# Altium schematic sheet SiLabsProg2_V14C.SchDoc
size A2; PageSetup: Record=PageOptions|CenterHorizontal=True|CenterVertical=True|PrintScale=0.97|XCorrection=1.00|YCorrection=1.00|PrintKind=2|BorderSize=5000000|LeftOffset=0|BottomOffset=0|Orientation=2|PaperLength=1000|PaperWidth=1000|Scale=100|PaperSource=7|PrintQuality=-4|MediaType=1|DitherType=10|PaperKind=A4|PrintScaleMode=1
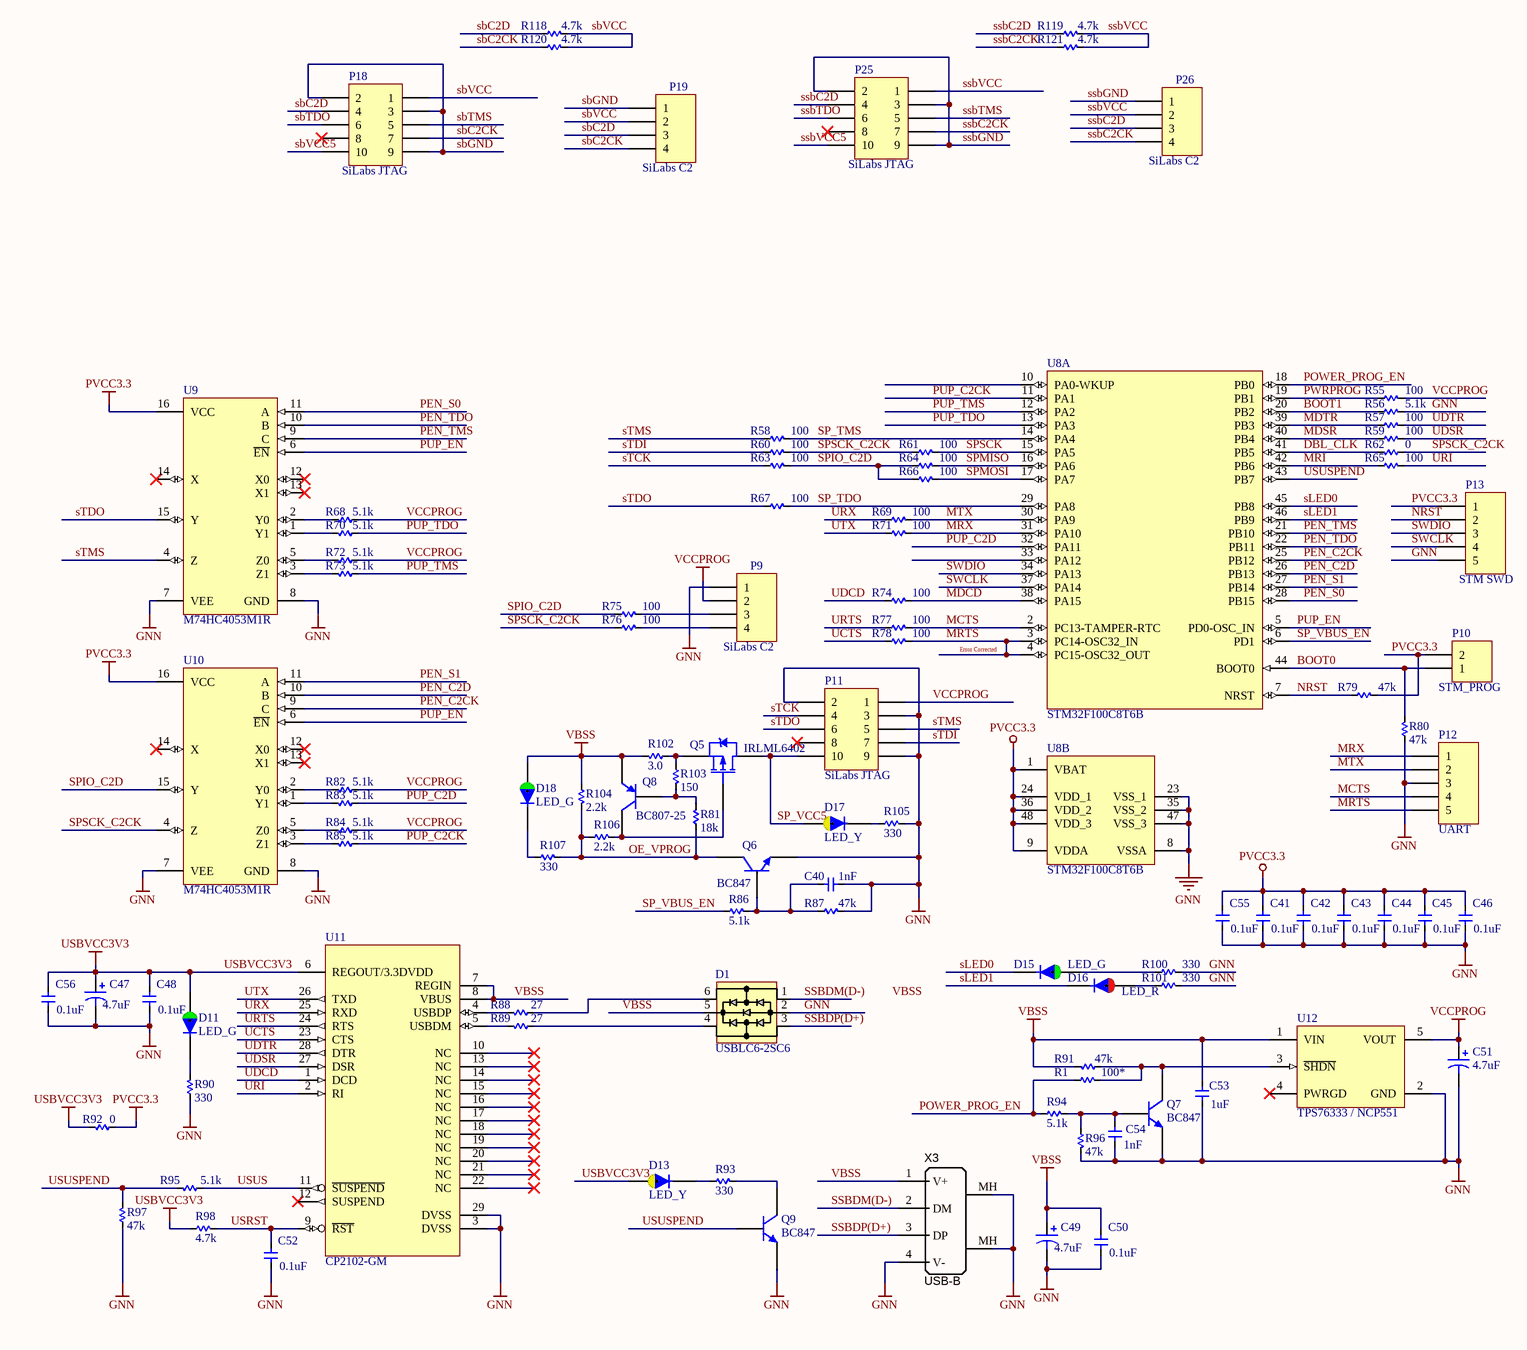
[diagram p0: SiLabsProg2_V14C.SchDoc]

## Parts
C40  1nF  [R1608_CAP]
C41  0.1uF  [R1005_CAP]
C42  0.1uF  [R1005_CAP]
C43  0.1uF  [R1005_CAP]
C44  0.1uF  [R1005_CAP]
C45  0.1uF  [R1005_CAP]
C46  0.1uF  [R1005_CAP]
C47  4.7uF  [CAPC3225L]
C48  0.1uF  [R1005_CAP]
C49  4.7uF  [CAPC3225L]
C50  0.1uF  [R1005_CAP]
C51  4.7uF  [CAPC3225L]
C52  0.1uF  [R1005_CAP]
C53  1uF  [R1608_CAP]
C54  1nF  [R1608_CAP]
C55  0.1uF  [R1005_CAP]
C56  0.1uF  [R1005_CAP]
D1  USBLC6-2SC6  [SOT23-6]
D11  LED_G  [LED3G]
D13  LED_Y  [LED3Y]
D15  LED_G  [LED3G]
D16  LED_R  [LED3R]
D17  LED_Y  [LED3Y]
D18  LED_G  [LED3G]
P9  SiLabs C2  [HDR1X4]
P10  STM_PROG  [HDR1X2]
P11  SiLabs JTAG  [HDR2X5]
P12  UART  [HDR1X5]
P13  STM SWD  [HDR1X5]
P18  SiLabs JTAG  [HDR2X5]
P19  SiLabs C2  [HDR1X4]
P25  SiLabs JTAG  [HDR2X5]
P26  SiLabs C2  [HDR1X4]
Q5  IRLML6402  [SOT23-1]
Q6  BC847  [SOT23-1]
Q7  BC847  [SOT23-1]
Q8  BC807-25  [SOT23-1]
Q9  BC847  [SOT23-1]
R1  100*  [R1608_RES]
R55  100  [R1608_RES]
R56  5.1k  [R1608_RES]
R57  100  [R1608_RES]
R58  100  [R1608_RES]
R59  100  [R1608_RES]
R60  100  [R1608_RES]
R61  100  [R1608_RES]
R62  0  [R1608_RES]
R63  100  [R1608_RES]
R64  100  [R1608_RES]
R65  100  [R1608_RES]
R66  100  [R1608_RES]
R67  100  [R1608_RES]
R68  5.1k  [R1608_RES]
R69  100  [R1608_RES]
R70  5.1k  [R1608_RES]
R71  100  [R1608_RES]
R72  5.1k  [R1608_RES]
R73  5.1k  [R1608_RES]
R74  100  [R1608_RES]
R75  100  [R1608_RES]
R76  100  [R1608_RES]
R77  100  [R1608_RES]
R78  100  [R1608_RES]
R79  47k  [R1608_RES]
R80  47k  [R1608_RES]
R81  18k  [R1608_RES]
R82  5.1k  [R1608_RES]
R83  5.1k  [R1608_RES]
R84  5.1k  [R1608_RES]
R85  5.1k  [R1608_RES]
R86  5.1k  [R1608_RES]
R87  47k  [R1608_RES]
R88  27  [R1608_RES]
R89  27  [R1608_RES]
R90  330  [R1608_RES]
R91  47k  [R1608_RES]
R92  0  [R1608_RES]
R93  330  [R1608_RES]
R94  5.1k  [R1608_RES]
R95  5.1k  [R1608_RES]
R96  47k  [R1608_RES]
R97  47k  [R1608_RES]
R98  4.7k  [R1608_RES]
R100  330  [R1608_RES]
R101  330  [R1608_RES]
R102  3.0  [R1608_RES]
R103  150  [R1608_RES]
R104  2.2k  [R1608_RES]
R105  330  [R1608_RES]
R106  2.2k  [R1608_RES]
R107  330  [R1608_RES]
R118  value 4.7k  [R1608_RES]  (hidden comment: R)
R119  value 4.7k  [R1608_RES]  (hidden comment: R)
R120  value 4.7k  [R1608_RES]  (hidden comment: R)
R121  value 4.7k  [R1608_RES]  (hidden comment: R)
U8  STM32F100C8T6B  [LQFP48_N]  (parts A,B of 2)
U9  M74HC4053M1R  [SO16_N]
U10  M74HC4053M1R  [SO16_N]
U11  CP2102-GM  [QFN28]
U12  TPS76333 / NCP551  [SOT23-5D]
X3  USB-B  [USB_TypeB_Tyco]

## Nets
GNN: C40.1 C41.1 C42.1 C43.1 C44.1 C45.1 C46.1 C47.2 C48.1 C49.2 C50.1 C51.2 C52.1 C53.1 C54.1 C55.1 C56.1 D1.2(GND) P9.1 P11.2 P11.3 P11.9 P12.3 P13.5 Q6.2(E) Q7.2(E) Q9.2(E) R56.2 R80.1 R87.2 R90.1 R96.2 R97.1 R100.2 R101.2 R105.2 U8.8(VSSA) U8.23(VSS_1) U8.35(VSS_2) U8.47(VSS_3) U9.7(VEE) U9.8(GND) U10.7(VEE) U10.8(GND) U11.3(DVSS) U11.29(DVSS) U12.2(GND) X3.4(V-) X3.MH(Shell)
PVCC3.3: C41.2 C42.2 C43.2 C44.2 C45.2 C46.2 C55.2 P10.2 P13.1 R79.2 R92.1 U8.1(VBAT) U8.9(VDDA) U8.24(VDD_1) U8.36(VDD_2) U8.48(VDD_3) U9.16(VCC) U10.16(VCC)
USBVCC3V3: C47.1 C48.2 C56.2 D11.2(A) D13.2(A) R92.2 R98.1 U11.6(REGOUT/3.3DVDD)
VBSS: C49.1 C50.2 C53.2 D1.5(VP) D18.2(A) Q8.2(E) R91.2 R102.2 R104.1 U11.7(REGIN) U11.8(VBUS) U12.1(VIN) X3.1(V+)
VCCPROG: C51.1 P9.2 P11.1 R55.2 R68.1 R72.1 R82.1 R84.1 U12.5(VOUT)
BOOT0: P10.1 R80.2 U8.44(BOOT0)
BOOT1: R56.1 U8.20(PB2)
DBL_CLK: R62.2 U8.41(PB5)
MCTS: P12.4 R77.2 U8.2(PC13-TAMPER-RTC)
MDCD: R74.2 U8.38(PA15)
MDSR: R59.1 U8.40(PB4)
MDTR: R57.1 U8.39(PB3)
MRI: R65.1 U8.42(PB6)
MRTS: P12.5 R78.2 U8.3(PC14-OSC32_IN) U8.4(PC15-OSC32_OUT)
MRX: P12.1 R71.2 U8.31(PA10)
MTX: P12.2 R69.2 U8.30(PA9)
NRST: P13.2 R79.1 U8.7(NRST)
OE_VPROG: Q6.3(C) R81.1 R104.2 R106.1 R107.2
PEN_C2CK: U8.25(PB12) U10.9(C)
PEN_C2D: U8.26(PB13) U10.10(B)
PEN_S0: U8.28(PB15) U9.11(A)
PEN_S1: U8.27(PB14) U10.11(A)
PEN_TDO: U8.22(PB11) U9.10(B)
PEN_TMS: U8.21(PB10) U9.9(C)
POWER_PROG_EN: R1.1 R94.1 U8.18(PB0)
PUP_C2CK: R85.1 U8.11(PA1)
PUP_C2D: R83.1 U8.32(PA11)
PUP_EN: U8.5(PD0-OSC_IN) U9.6(~{EN}) U10.6(~{EN})
PUP_TDO: R70.1 U8.13(PA3)
PUP_TMS: R73.1 U8.12(PA2)
PWRPROG: R55.1 U8.19(PB1)
sbC2CK: P18.7 P19.4 R120.1
sbC2D: P18.4 P19.3 R118.1
sbGND: P18.2 P18.3 P18.9 P19.1
sbTDO: P18.6
sbTMS: P18.5
sbVCC: P18.1 P19.2 R118.2 R120.2
sbVCC5: P18.10
sLED0: D15.1(K) U8.45(PB8)
sLED1: D16.1(K) U8.46(PB9)
SP_TDO: R67.2 U8.29(PA8)
SP_TMS: R58.2 U8.14(PA4)
SP_VBUS_EN: R86.1 U8.6(PD1)
SP_VCC5: D17.2(A) P11.10 Q5.3(D)
SPIO_C2D: R63.2 R64.1 R66.1 R75.1 U10.15(Y)
SPMISO: R64.2 U8.16(PA6)
SPMOSI: R66.2 U8.17(PA7)
SPSCK: R61.2 U8.15(PA5)
SPSCK_C2CK: R60.2 R61.1 R62.1 R76.1 U10.4(Z)
ssbC2CK: P25.7 P26.4 R121.1
ssbC2D: P25.4 P26.3 R119.1
SSBDM(D-): D1.1(IO1) X3.2(DM)
SSBDP(D+): D1.3(IO3) X3.3(DP)
ssbGND: P25.2 P25.3 P25.9 P26.1
ssbTDO: P25.6
ssbTMS: P25.5
ssbVCC: P25.1 P26.2 R119.2 R121.2
ssbVCC5: P25.10
sTCK: P11.4 R63.1
sTDI: P11.7 R60.1
sTDO: P11.6 R67.1 U9.15(Y)
sTMS: P11.5 R58.1 U9.4(Z)
SWCLK: P13.4 U8.37(PA14)
SWDIO: P13.3 U8.34(PA13)
UCTS: R78.1 U11.23(CTS)
UDCD: R74.1 U11.1(DCD)
UDSR: R59.2 U11.27(DSR)
UDTR: R57.2 U11.28(DTR)
URI: R65.2 U11.2(RI)
URTS: R77.1 U11.24(RTS)
URX: R69.1 U11.25(RXD)
USRST: C52.2 R98.2 U11.9(~{RST})
USUS: R95.1 U11.11(~{SUSPEND})
USUSPEND: Q9.1(B) R95.2 R97.2 U8.43(PB7)
UTX: R71.1 U11.26(TXD)
NetC40_2: C40.2 Q6.1(B) R86.2 R87.1
NetC54_2: C54.2 Q7.1(B) R94.2 R96.1
NetD1_4: D1.4(IO4) R89.1
NetD1_6: D1.6(IO2) R88.1
NetD11_1: D11.1(K) R90.2
NetD13_1: D13.1(K) R93.1
NetD15_2: D15.2(A) R100.1
NetD16_2: D16.2(A) R101.1
NetD17_1: D17.1(K) R105.1
NetD18_1: D18.1(K) R107.1
NetP9_3: P9.3 R75.2
NetP9_4: P9.4 R76.2
NetQ5_1: Q5.1(G) Q8.3(C) R106.2
NetQ5_2: Q5.2(S) R102.1 R103.1
NetQ7_3: Q7.3(C) R1.2 R91.1 U12.3(~{SHDN})
NetQ8_1: Q8.1(B) R81.2 R103.2
NetQ9_3: Q9.3(C) R93.2
NetR68_2: R68.2 U9.2(Y0)
NetR70_2: R70.2 U9.1(Y1)
NetR72_2: R72.2 U9.5(Z0)
NetR73_2: R73.2 U9.3(Z1)
NetR82_2: R82.2 U10.2(Y0)
NetR83_2: R83.2 U10.1(Y1)
NetR84_2: R84.2 U10.5(Z0)
NetR85_2: R85.2 U10.3(Z1)
NetR88_2: R88.2 U11.4(USBDP)
NetR89_2: R89.2 U11.5(USBDM)

Not connected (* = marked no-connect by the designer): P11 8*; P18 8*; P25 8*; U8 10(PA0-WKUP) 33(PA12); U9 12(X0)* 13(X1)* 14(X)*; U10 12(X0)* 13(X1)* 14(X)*; U11 10(NC)* 12(SUSPEND)* 13(NC)* 14(NC)* 15(NC)* 16(NC)* 17(NC)* 18(NC)* 19(NC)* 20(NC)* 21(NC)* 22(NC)*; U12 4(PWRGD)*

## Notes on the sheet
- Error Corrected
- Labels drawn without touching a wire or pin: VBSS

## Library data of the parts
C40-C46 C48 C50 C52-C56 = C: Capacitor; Manufacturer: Generic Components; Class I: Passive; Published: 8-Jun-2000; Revision: July-2002: Re-released for DXP Platform.; Publisher: Altium Limited; Class II: Capacitor; Type: *
  C40 C54: Value: 1nF
  C41-C46 C48 C50 C52 C55 C56: Value: 0.1uF
  C53: Value: 1uF
C47 C49 C51 = Cap Pol1: Polarized Capacitor (Radial); Published: 8-Jun-2000; LatestRevisionDate: 17-Jul-2002; LatestRevisionNote: Re-released for DXP Platform.; PackageReference: RB7.6-15; Publisher: Altium Limited; Value: 4.7uF
D1 = USBLC6-2P6
P9 P19 P26 = Header 4: Header, 4-Pin; LatestRevisionDate: 17-Jul-2002; LatestRevisionNote: Re-released for DXP Platform.; Publisher: Altium Limited
P10 = Header 2: Header, 2-Pin; LatestRevisionDate: 17-Jul-2002; LatestRevisionNote: Re-released for DXP Platform.; Publisher: Altium Limited
P11 P18 P25 = Header 5X2: Header, 5-Pin, Dual row; LatestRevisionDate: 17-Jul-2002; LatestRevisionNote: Re-released for DXP Platform.; Publisher: Altium Limited
P12 P13 = Header 5: Header, 5-Pin; LatestRevisionDate: 17-Jul-2002; LatestRevisionNote: Re-released for DXP Platform.; Publisher: Altium Limited
Q5 = IRLML6401: HEXFET Power MOSFET; Published: 17-Sep-2003; DatasheetVersion: 2-Jul-2001; PackageVersion: Jul-2001; PackageReference: Micro3; Publisher: Altium Limited; PackageDescription: SOT-23; 3 Leads; Body 3.0 x 2.5 mm, inc. leads (LxW max); ComponentLink1Description: Manufacturer Link; ComponentLink1URL: http://www.irf.com/; ComponentLink2Description: Datasheet; ComponentLink2URL: http://www.irf.com/product-info/datasheets/data/IRLML6401.pdf
Q6 Q7 Q9 = BC847: NPN General-purpose Transistor; Published: 17-Sep-2003; LatestRevisionDate: 12-Dec-2006; LatestRevisionNote: IPC-7351 Footprint Added.; DatasheetVersion: 4-Feb-2002; PackageVersion: May-1999; PackageReference: SOT23; Publisher: Altium Limited; PackageDescription: 3-Pin SOT-23 Package 0.95 mm Pitch, 2.3 mm Lead Span; ComponentLink1Description: Manufacturer Link; ComponentLink1URL: http://www.semiconductors.philips.com/; ComponentLink2Description: Datasheet; ComponentLink2URL: http://www.semiconductors.philips.com/acrobat/datasheets/BC846_BC847_BC848_5.pdf
Q8 = BC807-25: PNP General-purpose Transistor; Published: 17-Sep-2003; LatestRevisionDate: 12-Dec-2006; LatestRevisionNote: IPC-7351 Footprint Added.; DatasheetVersion: 8-Apr-1999; PackageVersion: May-1999; PackageReference: SOT23; Publisher: Altium Limited; PackageDescription: 3-Pin SOT-23 Package 0.95 mm Pitch, 2.3 mm Lead Span; ComponentLink1Description: Manufacturer Link; ComponentLink1URL: http://www.semiconductors.philips.com/; ComponentLink2Description: Datasheet; ComponentLink2URL: http://www.semiconductors.philips.com/acrobat/datasheets/BC807_BC807W_BC327_5.pdf
R1 R55-R98 R100-R107 R118-R121 = R: Resistor; Manufacturer: Generic Components; Class I: Passive; Published: 8-Jun-2000; Revision: July-2002: Re-released for DXP Platform.; Publisher: Altium Limited; Class II: Resistor; Type: *
  R1: Value: 100*
  R55 R57-R61 R63-R67 R69 R71 R74-R78: Value: 100
  R56 R68 R70 R72 R73 R82-R86 R94 R95: Value: 5.1k
  R62 R92: Value: 0
  R79 R80 R87 R91 R96 R97: Value: 47k
  R81: Value: 18k
  R88 R89: Value: 27
  R90 R93 R100 R101 R105 R107: Value: 330
  R98: Value: 4.7k
  R102: Value: 3.0
  R103: Value: 150
  R104 R106: Value: 2.2k
U8 = STM32F100C8T6B: STM32 ARM-based 32-bit MCU Value Line with 64 kB Flash, 8 kB Internal RAM, Internal Code B, -40 to +85°C Temperature, 48-Pin LQFP, Tray; DatasheetVersion: rev6.0, Apr-2011; PackageVersion: rev13, Apr-2011; PackageReference: LQFP48; PackageDescription: 48-Pin Low-Profile Quad Flat Pack, 7 x 7 mm Body, 0.5 mm Pitch (LQFP48); ComponentLink1Description: Manufacturer URL; ComponentLink1URL: http://www.st.com/; ComponentLink2Description: STM32F100 Datasheet; ComponentLink2URL: http://www.st.com/internet/com/TECHNICAL_RESOURCES/TECHNICAL_LITERATURE/DATASHEET/CD00251732.pdf; ComponentLink3Description: STM32 Family Web Page; ComponentLink3URL: www.st.com/stm32
U9 U10 = M74HC4053M1R: Analog Multiplexer/Demultiplexer Triple 2-Channel; Published: 8-Jun-2000; LatestRevisionDate: 13-Apr-2006; LatestRevisionNote: IPC-7351 Footprint Added.; DatasheetVersion: Oct-1993; PackageVersion: May-1998; PackageReference: SO16; Publisher: Altium Limited; PackageDescription: 16-Pin Small Outline Integrated Circuit 1.27 mm Pitch; Code_IPC: SOIC127P600-16; ComponentLink1Description: Manufacturer Link; ComponentLink1URL: http://www.st.com/; ComponentLink2Description: Datasheet; ComponentLink2URL: http://www.st.com/stonline/products/literature/ds/7731/m74hc4053.pdf
U11 = CP2102-GM: Single Chip USB to UART Bridge, USB 2.0, 1024Bytes EEPROM.; Manufacture: Silicon Laboratories; Compliant: RoHS; CompliantInformationSource: Silicon Laboratries; PackageDocument: 2005-09; TempertureRange: Industrial (-40 to +85Cel); ComponentLink1Description: Manufacture Link; ComponentLink1URL: http://www.silabs.com/; ComponentLink2Description: Datasheet; ComponentLink2URL: https://www.silabs.com/Support Documents/TechnicalDocs/CP2102.pdf; DatasheetDocument: Rev. 1.1, 2005-09; PackageReference: QFN-28; Published: 2007-08-06; Publisher: A and A System Co., Ltd.; DigiKeyPartNumber: 336-1160-ND
U12 = TPS76333: 300 mA, Low Voltage, Low Quiescent Current LDO Regulator, 5-Pin SOT-23, Extended Temperature, Tape and Reel; Published: 29-Jan-2009; DatasheetVersion: revA, Aug-2007; PackageVersion: revAW, Oct-2008; PackageReference: SOT-23-OT5; Publisher: Altium Limited; PackageDescription: 5-Lead Plastic Small Outline Transistor (OT) [SOT-23]; Code_IPC: SOT23-5; ComponentLink1Description: Manufacturer Link; ComponentLink1URL: http://www.microchip.com; ComponentLink2Description: Datasheet; ComponentLink2URL: http://ww1.microchip.com/downloads/en/DeviceDoc/22070a.pdf; ComponentLink3Description: Packaging Specification; ComponentLink3URL: http://ww1.microchip.com/downloads/en/PackagingSpec/00049AW.pdf
X3 = USB_TypeB: Connector THT Type B USB connector; Manufacturer Part Number 1: 292304-1; Manufacturer 1: TE Connectivity; Specifications: USB 2.0; Package / Case: R/A Type B; Supplier 1: Digi-Key; Connector Type: USB - B; Supplier Part Number 1: A31725-ND
D11 D15 D18 = LED_G: Published: 8-Jun-2000; LatestRevisionDate: 17-Jul-2002; LatestRevisionNote: Re-released for DXP Platform.; DatasheetDocument: Dec-1997; PackageReference: D-64; Publisher: Altium Limited; ComponentLink1Description: Manufacturer Link; ComponentLink1URL: http://www.irf.com/; ComponentLink2Description: Datasheet; ComponentLink2URL: http://www.irf.com/product-info/datasheets/data/10mq040n.pdf
D13 D17 = LED_Y: Published: 8-Jun-2000; LatestRevisionDate: 17-Jul-2002; LatestRevisionNote: Re-released for DXP Platform.; DatasheetDocument: Dec-1997; PackageReference: D-64; Publisher: Altium Limited; ComponentLink1Description: Manufacturer Link; ComponentLink1URL: http://www.irf.com/; ComponentLink2Description: Datasheet; ComponentLink2URL: http://www.irf.com/product-info/datasheets/data/10mq040n.pdf
D16 = LED_R: Published: 8-Jun-2000; LatestRevisionDate: 17-Jul-2002; LatestRevisionNote: Re-released for DXP Platform.; DatasheetDocument: Dec-1997; PackageReference: D-64; Publisher: Altium Limited; ComponentLink1Description: Manufacturer Link; ComponentLink1URL: http://www.irf.com/; ComponentLink2Description: Datasheet; ComponentLink2URL: http://www.irf.com/product-info/datasheets/data/10mq040n.pdf